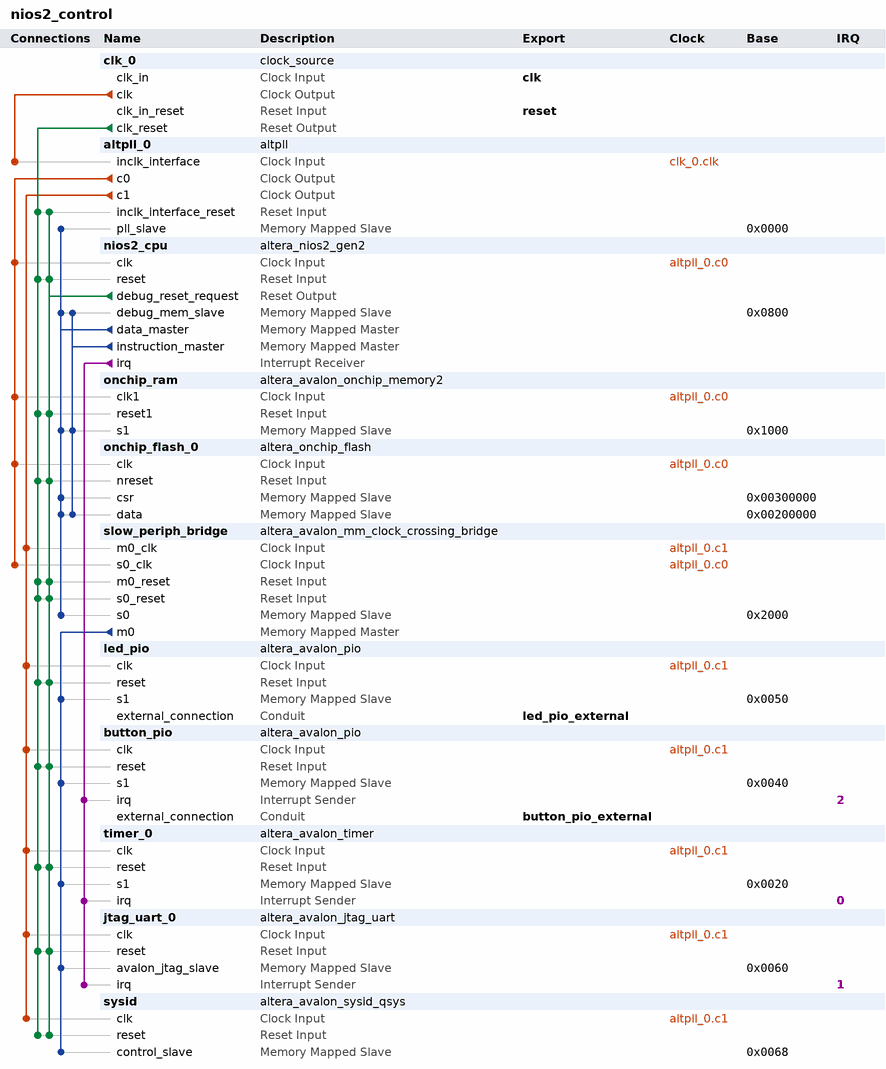
[diagram p0: system contents]
# Platform Designer (Qsys) system nios2_control, MAX 10 10M08DAF484C8GES
# Parameters at their usual value, and those the tool derives, are not listed.
package require -exact qsys 16.1
create_system nios2_control
set_project_property DEVICE_FAMILY {MAX 10}
set_project_property DEVICE 10M08DAF484C8GES

add_instance clk_0 clock_source 16.1
set_instance_parameter_value clk_0 clockFrequency 50000000

add_instance altpll_0 altpll 16.1
set_instance_parameter_value altpll_0 CLK0_DIVIDE_BY 5
set_instance_parameter_value altpll_0 CLK0_MULTIPLY_BY 8
set_instance_parameter_value altpll_0 CLK1_DIVIDE_BY 5
set_instance_parameter_value altpll_0 CLK1_DUTY_CYCLE 50
set_instance_parameter_value altpll_0 CLK1_MULTIPLY_BY 4
set_instance_parameter_value altpll_0 CLK1_PHASE_SHIFT 0
set_instance_parameter_value altpll_0 INCLK0_INPUT_FREQUENCY 20000
set_instance_parameter_value altpll_0 PORT_ARESET PORT_UNUSED
set_instance_parameter_value altpll_0 PORT_LOCKED PORT_UNUSED
set_instance_parameter_value altpll_0 PORT_clk1 PORT_USED
set_instance_parameter_value altpll_0 PORT_clk2 PORT_UNUSED
set_instance_parameter_value altpll_0 PORT_clk3 PORT_UNUSED

add_instance nios2_cpu altera_nios2_gen2 16.1
set_instance_parameter_value nios2_cpu dcache_size 2048
set_instance_parameter_value nios2_cpu debug_hwbreakpoint 2
set_instance_parameter_value nios2_cpu exceptionSlave onchip_ram.s1
set_instance_parameter_value nios2_cpu icache_size 2048
set_instance_parameter_value nios2_cpu impl Fast
set_instance_parameter_value nios2_cpu resetSlave onchip_ram.s1

add_instance onchip_ram altera_avalon_onchip_memory2 16.1
set_instance_parameter_value onchip_ram dataWidth 32
set_instance_parameter_value onchip_ram dualPort false
set_instance_parameter_value onchip_ram initMemContent false
set_instance_parameter_value onchip_ram initializationFileName onchip_mem.hex
set_instance_parameter_value onchip_ram memorySize 4096

add_instance onchip_flash_0 altera_onchip_flash 16.1
set_instance_parameter_value onchip_flash_0 CLOCK_FREQUENCY 80.0
set_instance_parameter_value onchip_flash_0 CONFIGURATION_MODE {Single Uncompressed Image}
set_instance_parameter_value onchip_flash_0 SECTOR_ACCESS_MODE {Read and write,Read and write,Read only,Read and write,Read and write}
set_instance_parameter_value onchip_flash_0 initFlashContent false
set_instance_parameter_value onchip_flash_0 initializationFileName altera_onchip_flash.hex
set_instance_parameter_value onchip_flash_0 useNonDefaultInitFile false

add_instance slow_periph_bridge altera_avalon_mm_clock_crossing_bridge 16.1
set_instance_parameter_value slow_periph_bridge ADDRESS_UNITS WORDS
set_instance_parameter_value slow_periph_bridge ADDRESS_WIDTH 10
set_instance_parameter_value slow_periph_bridge COMMAND_FIFO_DEPTH 8
set_instance_parameter_value slow_periph_bridge DATA_WIDTH 32
set_instance_parameter_value slow_periph_bridge MASTER_SYNC_DEPTH 2
set_instance_parameter_value slow_periph_bridge MAX_BURST_SIZE 1
set_instance_parameter_value slow_periph_bridge RESPONSE_FIFO_DEPTH 32
set_instance_parameter_value slow_periph_bridge SLAVE_SYNC_DEPTH 2
set_instance_parameter_value slow_periph_bridge USE_AUTO_ADDRESS_WIDTH 0

add_instance led_pio altera_avalon_pio 16.1
set_instance_parameter_value led_pio direction Output
set_instance_parameter_value led_pio width 8

add_instance button_pio altera_avalon_pio 16.1
set_instance_parameter_value button_pio captureEdge true
set_instance_parameter_value button_pio direction Input
set_instance_parameter_value button_pio edgeType FALLING
set_instance_parameter_value button_pio generateIRQ true
set_instance_parameter_value button_pio irqType EDGE
set_instance_parameter_value button_pio simDoTestBenchWiring true
set_instance_parameter_value button_pio simDrivenValue 15
set_instance_parameter_value button_pio width 4

add_instance timer_0 altera_avalon_timer 16.1
set_instance_parameter_value timer_0 period 1
set_instance_parameter_value timer_0 periodUnits MSEC

add_instance jtag_uart_0 altera_avalon_jtag_uart 16.1
set_instance_parameter_value jtag_uart_0 simInteractiveOptions NO_INTERACTIVE_WINDOWS

add_instance sysid altera_avalon_sysid_qsys 16.1
set_instance_parameter_value sysid id 0

# connections
add_connection altpll_0.c0 nios2_cpu.clk clock
add_connection altpll_0.c0 onchip_flash_0.clk clock
add_connection altpll_0.c0 onchip_ram.clk1 clock
add_connection altpll_0.c0 slow_periph_bridge.s0_clk clock
add_connection altpll_0.c1 button_pio.clk clock
add_connection altpll_0.c1 jtag_uart_0.clk clock
add_connection altpll_0.c1 led_pio.clk clock
add_connection altpll_0.c1 slow_periph_bridge.m0_clk clock
add_connection altpll_0.c1 sysid.clk clock
add_connection altpll_0.c1 timer_0.clk clock
add_connection clk_0.clk altpll_0.inclk_interface clock
add_connection clk_0.clk_reset altpll_0.inclk_interface_reset reset
add_connection clk_0.clk_reset button_pio.reset reset
add_connection clk_0.clk_reset jtag_uart_0.reset reset
add_connection clk_0.clk_reset led_pio.reset reset
add_connection clk_0.clk_reset nios2_cpu.reset reset
add_connection clk_0.clk_reset onchip_flash_0.nreset reset
add_connection clk_0.clk_reset onchip_ram.reset1 reset
add_connection clk_0.clk_reset slow_periph_bridge.m0_reset reset
add_connection clk_0.clk_reset slow_periph_bridge.s0_reset reset
add_connection clk_0.clk_reset sysid.reset reset
add_connection clk_0.clk_reset timer_0.reset reset
add_connection nios2_cpu.debug_reset_request altpll_0.inclk_interface_reset reset
add_connection nios2_cpu.debug_reset_request button_pio.reset reset
add_connection nios2_cpu.debug_reset_request jtag_uart_0.reset reset
add_connection nios2_cpu.debug_reset_request led_pio.reset reset
add_connection nios2_cpu.debug_reset_request nios2_cpu.reset reset
add_connection nios2_cpu.debug_reset_request onchip_flash_0.nreset reset
add_connection nios2_cpu.debug_reset_request onchip_ram.reset1 reset
add_connection nios2_cpu.debug_reset_request slow_periph_bridge.m0_reset reset
add_connection nios2_cpu.debug_reset_request slow_periph_bridge.s0_reset reset
add_connection nios2_cpu.debug_reset_request sysid.reset reset
add_connection nios2_cpu.debug_reset_request timer_0.reset reset
add_connection nios2_cpu.data_master altpll_0.pll_slave avalon
set_connection_parameter_value nios2_cpu.data_master/altpll_0.pll_slave baseAddress 0x0000
add_connection nios2_cpu.data_master nios2_cpu.debug_mem_slave avalon
set_connection_parameter_value nios2_cpu.data_master/nios2_cpu.debug_mem_slave baseAddress 0x0800
add_connection nios2_cpu.data_master onchip_flash_0.csr avalon
set_connection_parameter_value nios2_cpu.data_master/onchip_flash_0.csr baseAddress 0x00300000
add_connection nios2_cpu.data_master onchip_flash_0.data avalon
set_connection_parameter_value nios2_cpu.data_master/onchip_flash_0.data baseAddress 0x00200000
add_connection nios2_cpu.data_master onchip_ram.s1 avalon
set_connection_parameter_value nios2_cpu.data_master/onchip_ram.s1 baseAddress 0x1000
add_connection nios2_cpu.data_master slow_periph_bridge.s0 avalon
set_connection_parameter_value nios2_cpu.data_master/slow_periph_bridge.s0 baseAddress 0x2000
add_connection nios2_cpu.instruction_master nios2_cpu.debug_mem_slave avalon
set_connection_parameter_value nios2_cpu.instruction_master/nios2_cpu.debug_mem_slave baseAddress 0x0800
add_connection nios2_cpu.instruction_master onchip_flash_0.data avalon
set_connection_parameter_value nios2_cpu.instruction_master/onchip_flash_0.data baseAddress 0x00200000
add_connection nios2_cpu.instruction_master onchip_ram.s1 avalon
set_connection_parameter_value nios2_cpu.instruction_master/onchip_ram.s1 baseAddress 0x1000
add_connection slow_periph_bridge.m0 button_pio.s1 avalon
set_connection_parameter_value slow_periph_bridge.m0/button_pio.s1 baseAddress 0x0040
add_connection slow_periph_bridge.m0 jtag_uart_0.avalon_jtag_slave avalon
set_connection_parameter_value slow_periph_bridge.m0/jtag_uart_0.avalon_jtag_slave baseAddress 0x0060
add_connection slow_periph_bridge.m0 led_pio.s1 avalon
set_connection_parameter_value slow_periph_bridge.m0/led_pio.s1 baseAddress 0x0050
add_connection slow_periph_bridge.m0 sysid.control_slave avalon
set_connection_parameter_value slow_periph_bridge.m0/sysid.control_slave baseAddress 0x0068
add_connection slow_periph_bridge.m0 timer_0.s1 avalon
set_connection_parameter_value slow_periph_bridge.m0/timer_0.s1 baseAddress 0x0020
add_connection nios2_cpu.irq button_pio.irq interrupt
set_connection_parameter_value nios2_cpu.irq/button_pio.irq irqNumber 2
add_connection nios2_cpu.irq jtag_uart_0.irq interrupt
set_connection_parameter_value nios2_cpu.irq/jtag_uart_0.irq irqNumber 1
add_connection nios2_cpu.irq timer_0.irq interrupt
set_connection_parameter_value nios2_cpu.irq/timer_0.irq irqNumber 0

# exported interfaces
add_interface button_pio_external conduit end
set_interface_property button_pio_external EXPORT_OF button_pio.external_connection
add_interface clk clock sink
set_interface_property clk EXPORT_OF clk_0.clk_in
add_interface led_pio_external conduit end
set_interface_property led_pio_external EXPORT_OF led_pio.external_connection
add_interface reset reset sink
set_interface_property reset EXPORT_OF clk_0.clk_in_reset

set_interconnect_requirement {$system} qsys_mm.clockCrossingAdapter HANDSHAKE
set_interconnect_requirement {$system} qsys_mm.enableEccProtection FALSE
set_interconnect_requirement {$system} qsys_mm.insertDefaultSlave FALSE
set_interconnect_requirement {$system} qsys_mm.maxAdditionalLatency 1

save_system nios2_control.qsys
